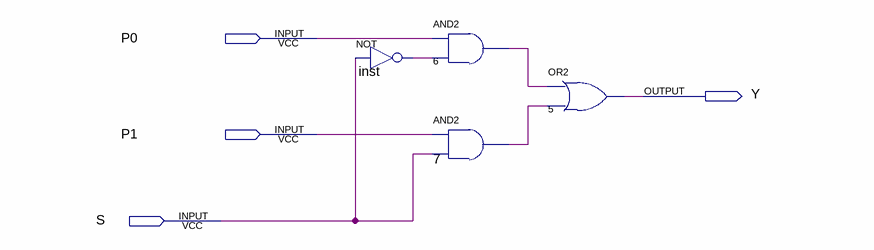
[diagram p0: schematic sheet]
// Quartus schematic Mux.bdf as structural Verilog: 4 symbols, 4 pins
module Mux (
  input  P0,
  input  P1,
  input  S,
  output Y
);

  wire inst_out, n6_out, n7_out;

  not inst (inst_out, S);
  and u_6 (n6_out, P0, inst_out);
  and u_7 (n7_out, P1, S);
  or u_5 (Y, n6_out, n7_out);
endmodule
